# EAGLE design PIC-Sensor-101-50 (EAGLE 5.00)
TD3_SNIPPET: ARMJTAG_LARGE
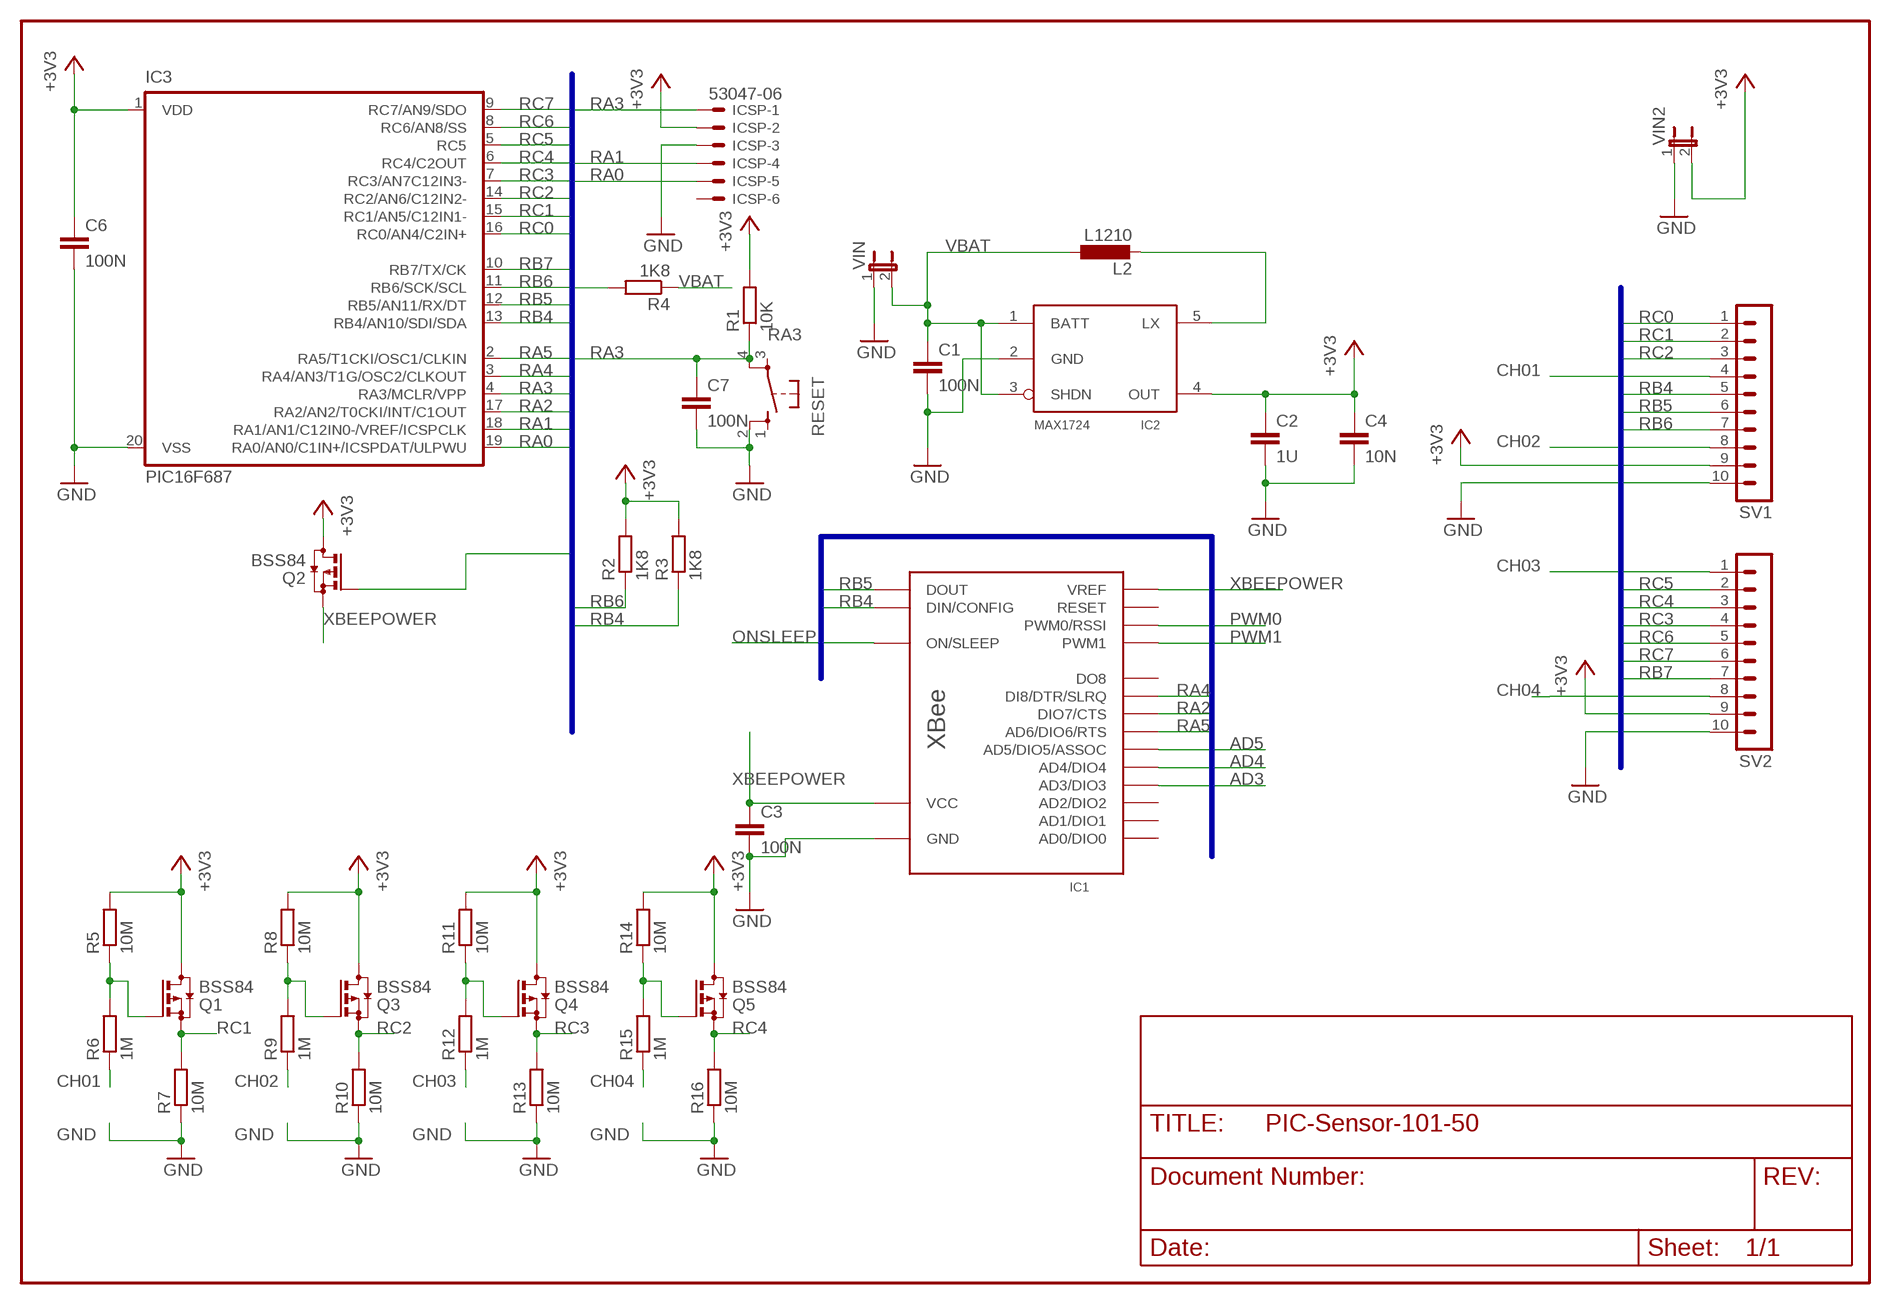
[diagram p0: schematic, sheet 1]

## Parts
C1  100N  C-EUC0805  [C0805]
C2  1U  C-EUC0805  [C0805]
C3  100N  C-EUC0805  [C0805]
C4  10N  C-EUC0805  [C0805]
C6  100N  C-EUC0805  [C0805]
C7  100N  C-EUC0805  [C0805]
IC1  XBEE  [XBEE]
IC2  MAX1724  [SOT23-5L]
IC3  PIC16F687  [SSOP20]
ICSP  53047-06  [53047-06]
L2  L1210  [C1210]
Q1  BSS84  [SOT23]
Q2  BSS84  [SOT23]
Q3  BSS84  [SOT23]
Q4  BSS84  [SOT23]
Q5  BSS84  [SOT23]
R1  10K  R-EU_M0805  [M0805]
R2  1K8  R-EU_M0805  [M0805]
R3  1K8  R-EU_M0805  [M0805]
R4  1K8  R-EU_M0805  [M0805]
R5  10M  R-EU_M0805  [M0805]
R6  1M  R-EU_M0805  [M0805]
R7  10M  R-EU_M0805  [M0805]
R8  10M  R-EU_M0805  [M0805]
R9  1M  R-EU_M0805  [M0805]
R10  10M  R-EU_M0805  [M0805]
R11  10M  R-EU_M0805  [M0805]
R12  1M  R-EU_M0805  [M0805]
R13  10M  R-EU_M0805  [M0805]
R14  10M  R-EU_M0805  [M0805]
R15  1M  R-EU_M0805  [M0805]
R16  10M  R-EU_M0805  [M0805]
RESET  10XX  [B3F-10XX]
SV1  MA10-1  [MA10-1]
SV2  MA10-1  [MA10-1]
VIN  JP1E  [JP1]
VIN2  JP1E  [JP1]

## Nets
+3V3: C2.1 C4.1 C6.1 IC2.4(OUT) IC3.1(VDD) ICSP.2 Q1.3(D) Q2.3(D) Q3.3(D) Q4.3(D) Q5.3(D) R1.2 R2.2 R3.2 R5.2 R8.2 R11.2 R14.2 SV1.9 SV2.9 VIN2.2
AD3: IC1.17(AD3/DIO3)
AD4: IC1.11(AD4/DIO4)
AD5: IC1.15(AD5/DIO5/ASSOC)
CH01: R6.1 SV1.4
CH02: R9.1 SV1.8
CH03: R12.1 SV2.1
CH04: R15.1 SV2.8
GND: C1.2 C2.2 C3.2 C4.2 C6.2 C7.2 IC1.10(GND) IC2.2(GND) IC3.20(VSS) ICSP.3 R7.1 R10.1 R13.1 R16.1 RESET.2 SV1.10 SV2.10 VIN2.1 VIN.1
N$1: Q1.1(G) R5.1 R6.2
N$2: IC2.5(LX) L2.2
N$4: Q3.1(G) R8.1 R9.2
N$6: Q4.1(G) R11.1 R12.2
N$8: Q5.1(G) R14.1 R15.2
ONSLEEP: IC1.13(ON/SLEEP)
PWM0: IC1.6(PWM0/RSSI)
PWM1: IC1.7(PWM1)
RA0: IC3.19(RA0/AN0/C1IN+/ICSPDAT/ULPWU) ICSP.5
RA1: IC3.18(RA1/AN1/C12IN0-/VREF/ICSPCLK) ICSP.4
RA2: IC1.12(DIO7/CTS) IC3.17(RA2/AN2/T0CKI/INT/C1OUT)
RA3: C7.1 IC3.4(RA3/MCLR/VPP) ICSP.1 R1.1 RESET.4
RA4: IC1.9(DI8/DTR/SLRQ) IC3.3(RA4/AN3/T1G/OSC2/CLKOUT)
RA5: IC1.16(AD6/DIO6/RTS) IC3.2(RA5/T1CKI/OSC1/CLKIN)
RB4: IC1.3(DIN/CONFIG) IC3.13(RB4/AN10/SDI/SDA) R3.1 SV1.5
RB5: IC1.2(DOUT) IC3.12(RB5/AN11/RX/DT) SV1.6
RB6: IC3.11(RB6/SCK/SCL) R2.1 SV1.7
RB7: IC3.10(RB7/TX/CK) SV2.7
RC0: IC3.16(RC0/AN4/C2IN+) SV1.1
RC1: IC3.15(RC1/AN5/C12IN1-) Q1.2(S) R7.2 SV1.2
RC2: IC3.14(RC2/AN6/C12IN2-) Q3.2(S) R10.2 SV1.3
RC3: IC3.7(RC3/AN7C12IN3-) Q4.2(S) R13.2 SV2.4
RC4: IC3.6(RC4/C2OUT) Q5.2(S) R16.2 SV2.3
RC5: IC3.5(RC5) Q2.1(G) SV2.2
RC6: IC3.8(RC6/AN8/SS) SV2.5
RC7: IC3.9(RC7/AN9/SDO) R4.2 SV2.6
VBAT: C1.1 IC2.1(BATT) IC2.3(SHDN) L2.1 R4.1 VIN.2
XBEEPOWER: C3.1 IC1.1(VCC) IC1.14(VREF) Q2.2(S)
Unconnected: IC1.4(DO8) IC1.5(RESET) IC1.18(AD2/DIO2) IC1.19(AD1/DIO1) IC1.20(AD0/DIO0) ICSP.6 RESET.1 RESET.3

## Buses
RA[0..5],RB[4..7],RC[0..7]

## Library data of the parts
C1-C4 C6 C7 = turbod3:C-EU: CAPACITOR, European symbol
IC1 = turbod3:XBEE
IC2 = turbod3:MAX1724
IC3 = microchip-5:PIC16F687*: MICROCONTROLLER PIC16F687 18 I/O One 16-bit timer One 8-bit timer Two comparators Precision internal oscillator-software selectable 8 MHz - 32 KHz SSP w/ I2C Compatible Address mask option EUSART LIN 2.0 Compatible 12 A/D Channels ULPW Enhanced Low Power Timer 1 Timer 1 Gate Synch Latch 2k Program Flash memory 128 bytes SRAM 256 bytes EEPROM
ICSP = con-molex:53?-06: CONNECTOR wire to board 1.25 mm (.049 inch) pitch header
L2 = turbod3:L
Q1-Q5 = transistor-small-signal:BSS84: P-CHANNEL MOS FET
R1-R16 = turbod3:R-EU_: RESISTOR, European symbol
RESET = KEY_B:10XX
SV1 SV2 = con-lstb:MA10-1: PIN HEADER
VIN VIN2 = jumper:JP1E: JUMPER

## Net classes
0 default: width 0.305 mm

## Board
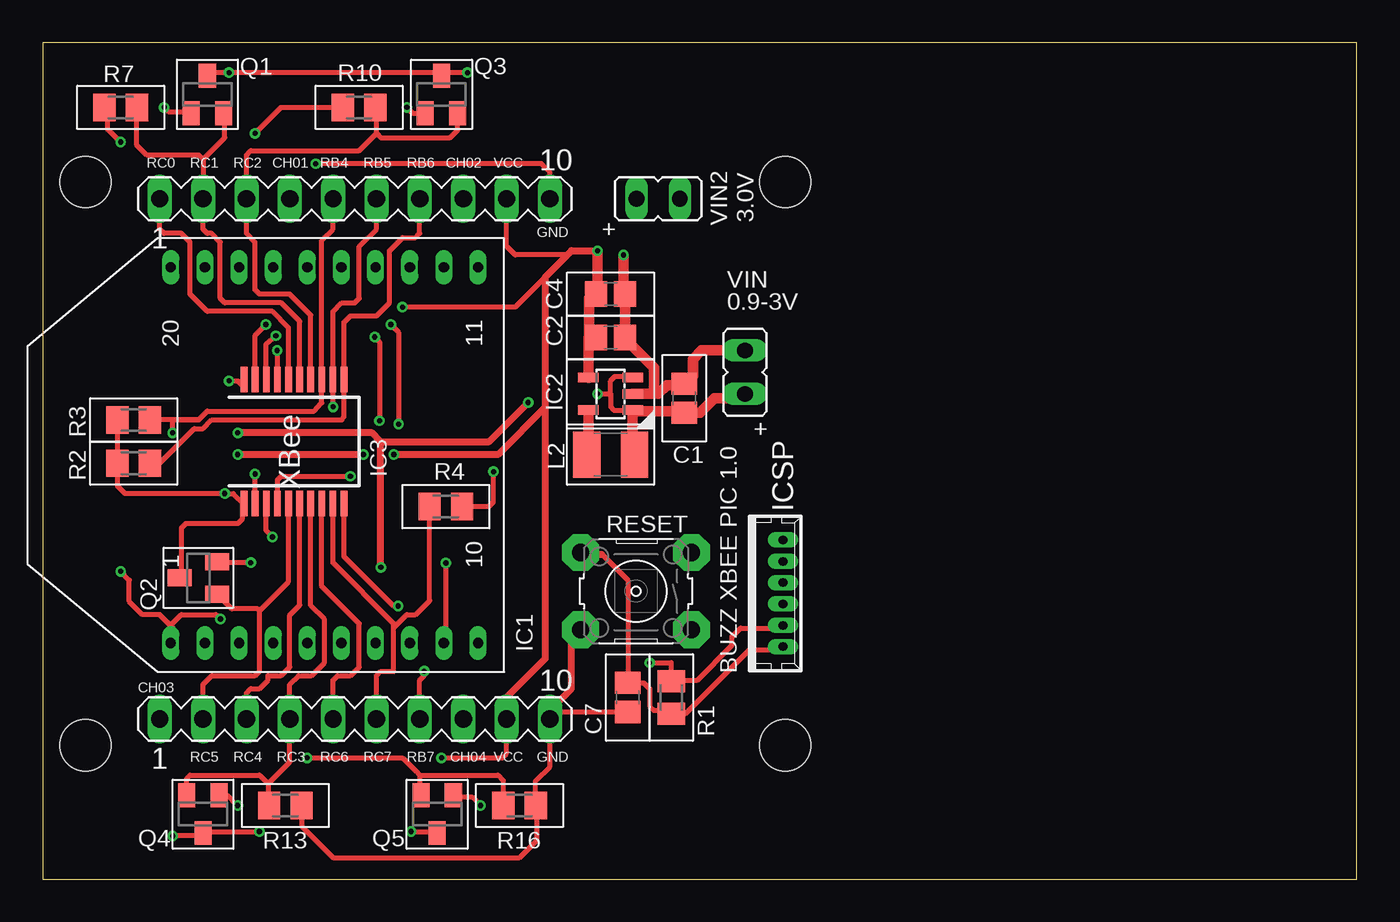
[diagram p1: board, top side]
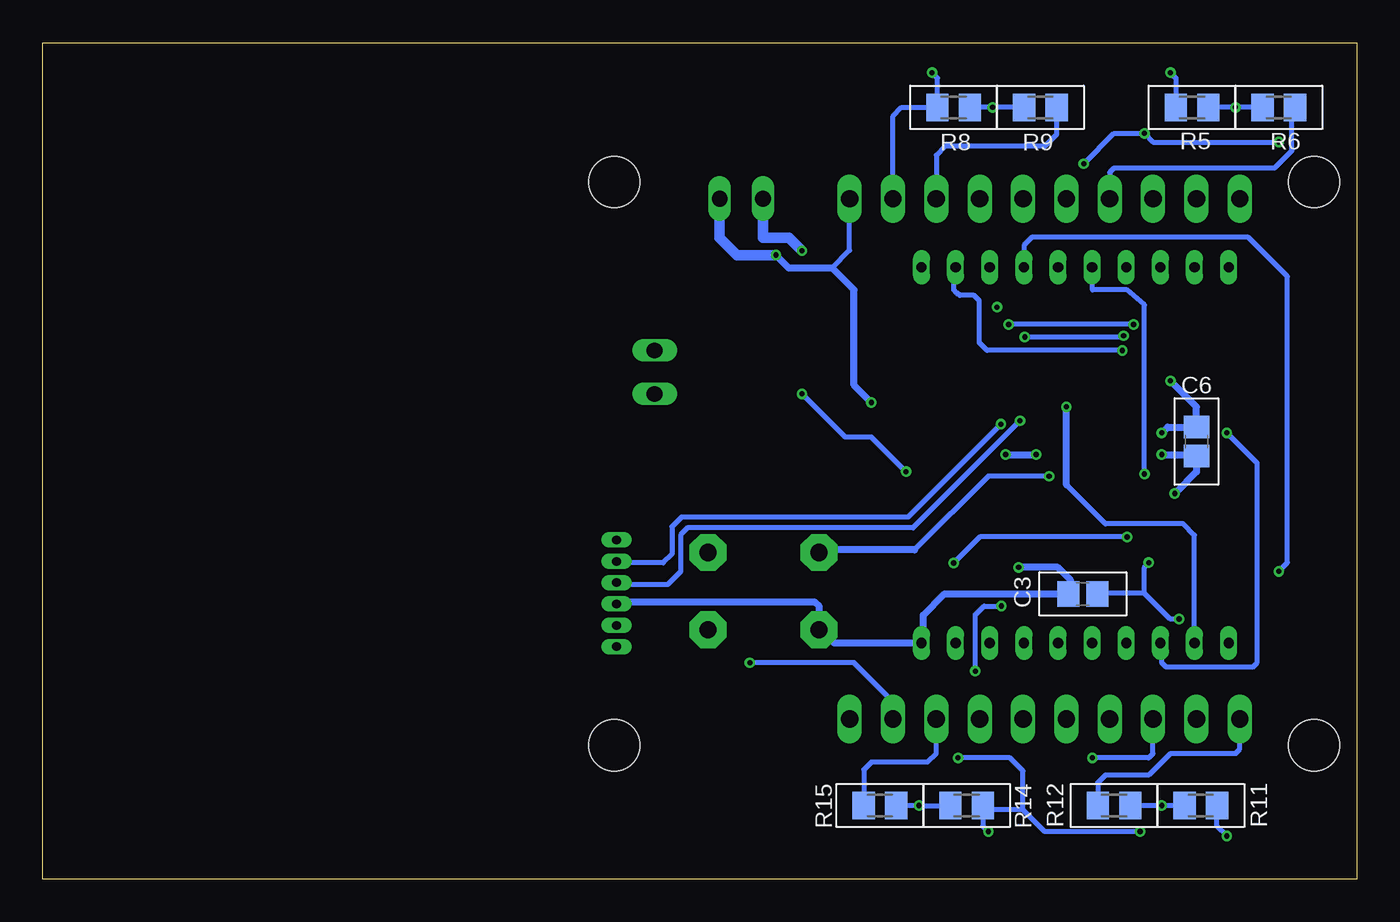
[diagram p2: board, bottom side, seen from below]

Size 77 x 49 mm. Coordinates in mm from the lower left corner, seen from the top.
Outline: 0,0 77,0 77,49 0,49 0,0
Copper layers (1*16): Top 0.035mm / dielectric 1.5mm / Bottom 0.035mm
Design rules "PCB-POOL": minimum track width 6mil, minimum drill 12mil, track to track 6mil, track to pad 6mil, pad to pad 6mil, via to via 6mil, smd to smd 6mil, copper to edge 20mil, drill to drill 8mil, minimum pad ring 8mil, minimum via ring 6mil, stop-mask expansion 3mil, vias tented up to drill 0mil, thermal gap 8mil
Holes 3 mm at 2.51,40.84 2.51,7.84 43.51,40.84 43.51,7.84

### Footprints (pad centres in the part's own frame; a part is rotated, then mirrored left to right if it is on the bottom)
C0805 = smd 1.3 x 1.5: 1 -0.85,0; 2 0.85,0
XBEE = drill 0.6 long: 1 -11,17; 2 -11,15; 3 -11,13; 4 -11,11; 5 -11,9; 6 -11,7; 7 -11,5; 8 -11,3; 9 -11,1; 10 -11,-1; 11 11,-1; 12 11,1; 13 11,3; 14 11,5; 15 11,7; 16 11,9; 17 11,11; 18 11,13; 19 11,15; 20 11,17
SOT23-5L = smd 0.55 x 1.2: 1 -0.95,-1.3; 2 0,-1.3; 3 0.95,-1.3; 4 0.95,1.3; 5 -0.95,1.3
SSOP20 = smd 0.4 x 1.5: 1 -2.925,-3.625; 2 -2.275,-3.625; 3 -1.625,-3.625; 4 -0.975,-3.625; 5 -0.325,-3.625; 6 0.325,-3.625; 7 0.975,-3.625; 8 1.625,-3.625; 9 2.275,-3.625; 10 2.925,-3.625; 11 2.925,3.625; 12 2.275,3.625; 13 1.625,3.625; 14 0.975,3.625; 15 0.325,3.625; 16 -0.325,3.625; 17 -0.975,3.625; 18 -1.625,3.625; 19 -2.275,3.625; 20 -2.925,3.625
53047-06 = drill 0.5 pad 0.698 long: 1 3.125,0.45; 2 1.875,0.45; 3 0.625,0.45; 4 -0.625,0.45; 5 -1.875,0.45; 6 -3.125,0.45
C1210 = smd 1.6 x 2.7: 1 -1.4,0; 2 1.4,0
SOT23 = smd 1 x 1.4: 1 -0.95,-1.1; 2 0.95,-1.1; 3 0,1.1
M0805 = smd 1.3 x 1.6: 1 -0.95,0; 2 0.95,0
B3F-10XX = drill 1.016 pad 2.159 octagon: 1 -3.379,2.312; 2 3.123,2.312; 3 -3.379,-2.209; 4 3.123,-2.209
MA10-1 = drill 1.016 long: 1 -11.43,0; 2 -8.89,0; 3 -6.35,0; 4 -3.81,0; 5 -1.27,0; 6 1.27,0; 7 3.81,0; 8 6.35,0; 9 8.89,0; 10 11.43,0
JP1 = drill 0.914 long: 1 0,-1.27; 2 0,1.27

### Placement (x,y rotation side)
C1  37.59,28.18 90 top
C2  33.27,31.73 0 top
C3  16.05,16.71 180 bottom
C4  33.27,34.27 0 top
C6  9.4,25.64 90 bottom
C7  34.29,10.65 270 top
IC1  24.51,24.84 90 top
IC2  33.27,28.43 90 top
IC3  14.73,25.64 0 top
ICSP  42.93,16.75 270 top
L2  33.27,24.88 180 top
Q1  9.65,45.97 0 top
Q2  9.13,17.65 90 top
Q3  23.37,45.97 0 top
Q4  9.4,3.81 180 top
Q5  23.11,3.81 180 top
R1  36.83,10.65 90 top
R2  5.33,24.37 180 top
R3  5.33,26.91 180 top
R4  23.62,21.83 180 top
R5  9.65,45.21 180 bottom
R6  4.57,45.21 180 bottom
R7  4.57,45.21 0 top
R8  23.62,45.21 180 bottom
R9  18.54,45.21 180 bottom
R10  18.54,45.21 0 top
R11  9.14,4.32 0 bottom
R12  14.22,4.32 0 bottom
R13  14.22,4.32 180 top
R14  22.86,4.32 0 bottom
R15  27.94,4.32 0 bottom
R16  27.94,4.32 180 top
RESET  34.64,16.93 180 top
SV1  18.29,39.86 0 top
SV2  18.29,9.38 0 top
VIN  41.15,29.7 180 top
VIN2  36.07,39.86 90 top

### Tracks (layer width: path | path; a pad name or v marks a point on that pad's centre or on a via)
+3V3  (via drill 0.3)
  Top 0.305: 4.38,24.18 R2.2 | 4.38,24.18 R3.2 | 4.38,24.18 4.32,24.11 | 4.38,24.18 4.38,23.03 4.83,22.59 v10.67,22.59 11.18,22.59 11.75,22.01 IC3.1 11.72,22.1 11.68,22.1 11.68,21.08 11.43,20.83 8.38,20.83 8.13,20.57 8.13,17.53 8.03,17.63 Q2.3 | ICSP.2 42.93,14.97 42.67,14.72 40.89,14.72 40.39,14.21 40.39,13.7 38.35,11.67 36.58,11.67 36.64,11.6 R1.2 36.83,12.68 v35.56,12.68 | v21.08,33.51 27.69,33.51 29.46,35.29 | SV2.9 27.18,7.37 26.92,7.11 v23.37,7.11 | 9.4,2.54 v7.62,2.54 | Q4.3 9.4,2.79 v12.7,2.79 | Q5.3 23.11,2.54 22.86,2.79 v21.59,2.79 | v24.89,47.24 23.62,47.24 23.37,46.99 Q3.3 23.37,47.24 v10.92,47.24 9.65,47.24 Q1.3 | SV1.9 27.18,37.08 27.69,36.58 30.73,36.58 30.99,36.83 30.99,36.81
  Top 0.406: C2.1 32.43,31.65 31.97,31.2 | C2.1 32,31.73 31.97,31.7 | C2.1 32.26,31.73 32,31.99 | C4.1 32.26,34.27 32,34.02 | v32.51,36.81 30.99,36.81 29.46,35.29 29.46,27.67 | 29.46,27.67 29.46,12.94 27.18,10.65 SV2.9 | v18.8,24.88 v11.43,24.88 | v20.57,24.88 26.67,24.88 29.46,27.67 | Q4.3 9.4,2.54
  Top 0.61: 31.97,31.7 IC2.4 | 32,34.02 32,31.99 | C4.1 32.42,34.44 32.51,34.53 v32.51,36.81
  Bottom 0.305: v35.56,12.68 29.46,12.68 27.18,10.4 | 10.67,45.21 10.66,45.2 R5.2 10.6,46.92 v10.92,47.24 | 8.38,4.57 8.13,4.32 R11.2 8.19,3.11 v7.62,2.54 | 21.91,4.13 R14.2 22.1,4.32 21.91,4.13 | v12.7,2.79 18.29,2.79 19.56,4.06 | v23.37,7.11 20.32,7.11 19.56,6.35 19.56,4.06 | 19.56,4.06 21.84,4.06 21.91,4.13 | 21.91,4.13 21.91,3.11 v21.59,2.79 | v24.89,47.24 24.57,46.92 R8.2 26.67,45.21 27.18,44.7 SV1.9 | v32.51,36.81 32.51,36.83
  Bottom 0.406: 9.4,24.62 9.4,23.86 v10.67,22.59 | 9.4,24.62 C6.1 | v11.43,24.88 9.65,24.88 9.4,24.62 | v20.57,24.88 v18.8,24.88 | SV2.9 27.18,10.4
  Bottom 0.61: v32.51,36.81 33.27,37.58 34.8,37.58 VIN2.2 34.54,40.12
CH01
  Bottom 0.305: SV1.4 14.48,41.4 14.22,41.66 4.83,41.66 3.81,42.67 3.81,45.21 R6.1
CH02
  Bottom 0.305: R9.1 17.59,43.62 18.29,42.93 24.13,42.93 24.64,42.42 24.64,40.13 24.89,39.88 24.88,39.86 SV1.8
CH03
  Bottom 0.305: SV2.1 6.86,7.62 7.11,7.37 10.92,7.37 12.19,6.1 14.73,6.1 15.17,5.65 R12.1 15.24,4.32
CH04
  Bottom 0.305: R15.1 28.89,6.42 28.45,6.86 25.15,6.86 24.64,7.37 SV2.8 24.64,9.4
GND  (via drill 0.3)
  Top 0.305: IC3.20 11.81,29.06 11.68,28.94 11.43,29.19 v10.92,29.19 | 29.72,9.64 29.72,9.89 | 29.72,9.4 29.72,9.64 | C7.2 29.88,9.8 29.72,9.64 | 3.62,45.79 R7.1 3.81,45.21 3.81,43.94 v4.57,43.18 | 29.72,9.4 SV2.10 | 29.72,9.4 29.72,6.6 28.89,5.78 R16.1 28.89,4.51 28.96,4.57 28.96,2.29 27.94,1.27 17.02,1.27 15.17,3.11 R13.1 | R10.1 13.97,45.21 v12.45,43.69 | SV1.10 29.72,41.4 29.21,41.91 v16,41.91
  Top 0.406: IC2.2 34.54,28.43 | 34.13,31.39 C2.2 34.09,31.68 34.04,31.73 | C1.2 37.59,28.94 38.1,29.45 | 35.81,28.43 36.07,28.43 | 34.04,34.27 34.12,34.19 | v11.43,26.15 19.3,26.15 19.81,25.64 | v19.81,18.27 19.81,25.64 | 19.81,25.64 26.16,25.64 v28.45,27.92 | RESET.2 31.52,14.7 31.5,14.72 30.99,14.21 30.99,11.16 29.72,9.89
  Top 0.61: 37.59,28.94 36.58,28.94 36.07,28.43 | IC2.2 35.81,28.43 35.81,29.96 34.09,31.68 | 34.12,34.19 C2.2 | C4.2 34.04,34.27 v34.04,36.56 | 38.1,29.45 38.1,30.46 38.61,30.97 VIN.1 41.4,30.72
  Bottom 0.305: v4.57,43.18 11.94,43.18 v12.45,43.69 14.22,43.69 v16,41.91 | 30.73,35.8 30.73,35.81 29.72,36.83 SV1.10
  Bottom 0.406: v34.04,36.56 33.27,35.8 30.73,35.8 29.46,34.53 29.46,28.94 v28.45,27.92 | ICSP.3 42.93,15.99 42.67,16.24 31.75,16.24 31.5,15.99 31.5,14.72 | v10.92,29.19 9.4,27.67 C6.2 11.09,26.49 v11.43,26.15 | v19.81,18.27 17.53,18.27 16.76,17.51 16.76,17 17.02,16.75 16.98,16.71 C3.2 24.16,16.71 25.4,15.48 25.4,13.7 25.51,13.81 IC1.10 30.62,13.84 31.5,14.72 | 31.5,14.72 31.52,14.7 RESET.2
  Bottom 0.61: v34.04,36.56 36.32,36.56 37.34,37.58 VIN2.1 37.34,40.12
N$1  (via drill 0.3)
  Top 0.305: v7.11,45.21 7.37,44.96 8.64,44.96 8.7,44.89 Q1.1
  Bottom 0.305: 8.72,45.08 8.71,45.09 | 8.72,45.08 R5.1 8.81,45.08 8.84,45.11 | 8.72,45.08 8.79,45.01 | R6.2 v7.11,45.21 8.59,45.21 8.72,45.08
N$2
  Top 0.406: L2.2 31.87,24.49 32,24.62 31.97,24.65
  Top 0.61: 31.97,24.65 IC2.5
N$4  (via drill 0.3)
  Top 0.305: Q3.1 21.67,44.87 v21.34,45.21
  Bottom 0.305: R9.2 v21.34,45.21 R8.1
N$6  (via drill 0.3)
  Top 0.305: Q4.1 10.84,4.91 v11.43,4.32
  Bottom 0.305: R12.2 v11.43,4.32 R11.1
N$8  (via drill 0.3)
  Top 0.305: 24.06,4.89 24.13,4.83 25.15,4.83 v25.65,4.32 | Q5.1 24.06,4.89 | 24.06,4.89 23.88,5.08
  Bottom 0.305: 23.62,4.32 R14.1 v25.65,4.32 R15.2 27.18,4.32
RA0  (via drill 0.3)
  Top 0.305: IC3.19 12.46,31.87 v13.08,32.5 | v20.85,26.65 20.85,32.04 v20.4,32.5
  Bottom 0.305: ICSP.5 43.08,18.62 43.18,18.53 40.64,18.53 40.13,19.03 40.13,20.66 39.57,21.22 26.29,21.22 v20.85,26.65 | v13.08,32.5 13.08,32.6 13.18,32.5 v20.4,32.5
RA1  (via drill 0.3)
  Top 0.305: IC3.18 13.11,31.38 v13.66,31.84 | v19.74,26.86 19.74,31.48 v19.46,31.76
  Bottom 0.305: 43.04,17.37 43.18,17.51 | 43.04,17.37 ICSP.4 | 43.04,17.37 42.93,17.26 40.39,17.26 39.62,18.02 39.62,20.18 39.22,20.58 26.01,20.58 v19.74,26.86 | v13.66,31.84 13.66,31.86 13.69,31.89 13.82,31.76 v19.46,31.76
RA2  (via drill 0.3)
  Top 0.305: IC3.17 13.76,30.93 v13.74,30.97
  Bottom 0.305: 23.43,34.34 23.62,34.53 23.62,35.92 23.54,35.84 IC1.12 | 23.43,34.34 23.37,34.27 | v13.74,30.97 21.67,30.97 22.12,31.43 22.12,33.89 22.43,34.2 23.27,34.2 23.42,34.35 23.43,34.34
RA3  (via drill 0.3)
  Top 0.305: IC3.4 13.76,23.39 13.97,23.61 v18.03,23.61 | ICSP.1 42.93,13.45 41.4,13.45 37.66,9.7 R1.1 36.9,9.7 37.08,9.89 35.81,9.89 35.56,10.14 35.56,11.16 35.22,11.5 C7.1 34.29,11.41 | 32.77,19.03 34.29,17.51 34.29,11.41 | 34.29,11.41 34.04,11.16
  Top 0.406: RESET.4 31.52,19.05 31.5,19.03 32.77,19.03
  Bottom 0.305: v18.03,23.61 21.59,23.61 25.91,19.29
  Bottom 0.406: RESET.4 31.52,19.05 31.5,19.03 31.24,19.29 25.91,19.29
RA4  (via drill 0.3)
  Top 0.305: IC3.3 13.11,20.41 v13.46,20.05 | IC1.9 23.48,13.84 23.37,13.95 23.62,14.21 v23.62,18.53
  Bottom 0.305: v13.46,20.05 22.1,20.05 v23.62,18.53
RA5  (via drill 0.3)
  Top 0.305: IC3.2 12.46,23.87 v12.45,23.73
  Bottom 0.305: v12.45,23.73 12.45,33.64 13.46,34.53 15.49,34.53 15.49,36.05 15.51,36.04 IC1.16
RB4  (via drill 0.3)
  Top 0.305: 9.14,26.91 R3.1 | 9.14,26.91 9.65,27.42 15.9,27.42 16.36,27.9 16.36,29.17 16.32,29.26 IC3.13 16.36,37.42 17.02,38.08 SV1.5 | 9.14,26.91 7.62,26.91 v7.62,26.15
  Bottom 0.305: v7.62,26.15 5.84,24.37 5.84,12.68 6.1,12.43 11.18,12.43 11.43,12.68 11.43,13.92 | 11.43,13.92 11.43,13.95 | 11.43,13.92 IC1.3
RB5  (via drill 0.3)
  Top 0.305: v17.02,27.67 17.01,27.68 IC3.12 17.01,33.25 17.53,33.77 18.29,33.77 18.54,34.02 18.54,37.07 19.56,38.08 SV1.6
  Bottom 0.305: 17.02,23.1 14.73,20.81 10.16,20.81 9.51,20.16 IC1.2
  Bottom 0.406: 17.02,23.1 v17.02,27.67
RB6
  Top 0.305: R2.1 6.86,24.37 8.89,26.4 9.4,26.4 9.91,26.91 17.53,26.91 17.65,27.09 17.65,29.22 17.71,29.26 IC3.11 17.66,32.63 18.03,33 19.56,33 20.32,33.77 20.32,36.81 21.08,37.58 21.84,37.58 22.1,37.83 22.1,39.61 21.84,39.86 SV1.7
RB7  (via drill 0.3)
  Top 0.305: IC3.10 17.66,18.9 17.67,18.9 20.57,16 v20.83,16 | SV2.7 22.1,11.67 22.35,11.92 v22.35,12.19
  Bottom 0.305: v20.83,16 21.84,16 22.35,15.49 v22.35,12.19
RC0
  Top 0.305: IC3.16 14.41,32.31 13.46,33.26 9.65,33.26 8.64,34.27 8.64,37.32 8.13,37.83 7.11,37.83 6.86,38.08 SV1.1
RC1
  Top 0.305: IC3.15 15.06,32.68 13.97,33.77 10.67,33.77 10.41,34.02 10.41,37.32 9.91,37.83 9.65,37.83 9.4,38.08 9.4,39.61 9.65,39.86 SV1.2 9.4,39.78 9.42,39.75 9.42,42.16 | 9.42,42.16 9.42,42.19 10.67,43.43 10.67,44.96 10.6,44.89 Q1.2 | R7.2 5.52,42.99 6.1,42.42 9.14,42.42 9.4,42.16 9.42,42.16
RC2
  Top 0.305: IC3.14 15.71,33.05 14.48,34.27 12.7,34.27 12.45,34.53 12.45,37.32 11.94,37.83 SV1.3 11.94,42.42 12.19,42.67 18.54,42.67 19.56,43.69 | Q3.2 24.32,43.88 23.88,43.43 19.81,43.43 19.56,43.69 | R10.2 19.56,45.21 19.56,43.69
RC3
  Top 0.305: IC3.7 15.71,16.03 16.51,15.22 16.51,12.68 15.75,11.92 14.99,11.92 14.48,11.41 SV2.4 14.48,6.86 13.21,5.59 | Q4.2 8.45,5.91 8.64,6.1 12.7,6.1 13.21,5.59 | R13.2 13.21,4.32 13.21,5.59
RC4  (via drill 0.3)
  Top 0.305: IC3.6 15.06,16.06 14.48,15.48 14.48,12.43 13.97,11.92 13.21,11.92 13.21,11.67 12.7,11.16 12.19,11.16 11.94,10.91 SV2.3 | v15.49,7.11 21.08,7.11 21.84,6.35 22.1,6.1 | Q5.2 22.16,4.89 22.1,4.83 22.1,6.1 | R16.2 26.99,5.78 26.67,6.1 22.1,6.1
  Bottom 0.305: v15.49,7.11 12.19,7.11 11.94,7.37 SV2.3 11.94,9.4
RC5
  Top 0.305: IC3.5 14.41,17.44 12.7,15.73 | 12.7,15.73 12.7,12.18 12.45,11.92 9.91,11.92 9.4,11.41 SV2.2 9.4,9.13 | 12.7,15.73 12.59,15.84 11.09,15.84 Q2.1
RC6
  Top 0.305: IC3.8 16.36,17.16 18.54,14.97 18.54,12.43 18.03,11.92 17.27,11.92 17.02,11.67 SV2.5
RC7
  Top 0.305: IC3.9 17.01,18.54 20.57,14.97 20.57,14.73 | 20.57,14.73 20.57,12.18 19.81,12.18 19.56,11.92 19.56,9.64 19.3,9.38 SV2.6 | R4.2 22.67,16.32 21.84,15.49 21.34,15.49 20.57,14.73
VBAT  (via drill 0.3)
  Top 0.305: IC2.1 33.46,27.48 33.27,27.67 33.27,28.43 | 33.27,28.43 33.27,29.19 33.53,29.45 34.8,29.45 | v32.51,28.43 33.27,28.43 | v26.42,23.88 26.42,22.1 26.16,21.84 24.64,21.84 24.62,21.83 R4.1
  Top 0.406: 34.63,27.33 34.54,27.42 34.57,27.45 IC2.1 | L2.1 34.67,24.49 34.54,24.62 34.57,24.65 | 34.8,29.45 34.73,29.38 IC2.3 | C1.1 37.59,27.16 37.43,27.33 37.17,27.33 37.08,27.42
  Top 0.61: IC2.1 34.57,24.65 | 34.54,27.42 37.08,27.42 | C1.1 38.52,27.33 39.37,28.18 41.15,28.18 41.4,28.43 VIN.2
  Bottom 0.305: v32.51,28.43 29.97,25.89 28.43,25.89 v26.42,23.88
XBEEPOWER  (via drill 0.3)
  Top 0.305: IC1.1 7.51,14.73 | 7.51,14.73 7.51,14.87 8.13,15.49 10.16,15.49 v10.41,15.24 | Q2.2 10.16,18.54 v12.19,18.54 | v4.57,18.03 5.08,17.53 5.08,16.26 5.84,15.49 6.86,15.49 7.62,14.73 7.51,14.73
  Bottom 0.305: v10.41,15.24 10.92,15.24 12.45,16.76 | C3.1 15.2,16.73 15.24,16.76 12.45,16.76 | 12.45,16.76 12.45,18.29 v12.19,18.54 | IC1.14 19.51,37.13 19.05,37.59 6.35,37.59 4.06,35.31 4.06,18.54 v4.57,18.03

### Text on the board
tNames: RC0 | RC1 | RC2 | CH01 | RB4 | RB5 | RB6 | CH02 | VCC | 3.0V | GND | + | 0.9-3V | + | BUZZ XBEE PIC 1.0 | CH03 | RC5 | RC4 | RC3 | RC6 | RC7 | RB7 | CH04 | VCC | GND